# EAGLE design n64rgb (EAGLE 8.4.3)
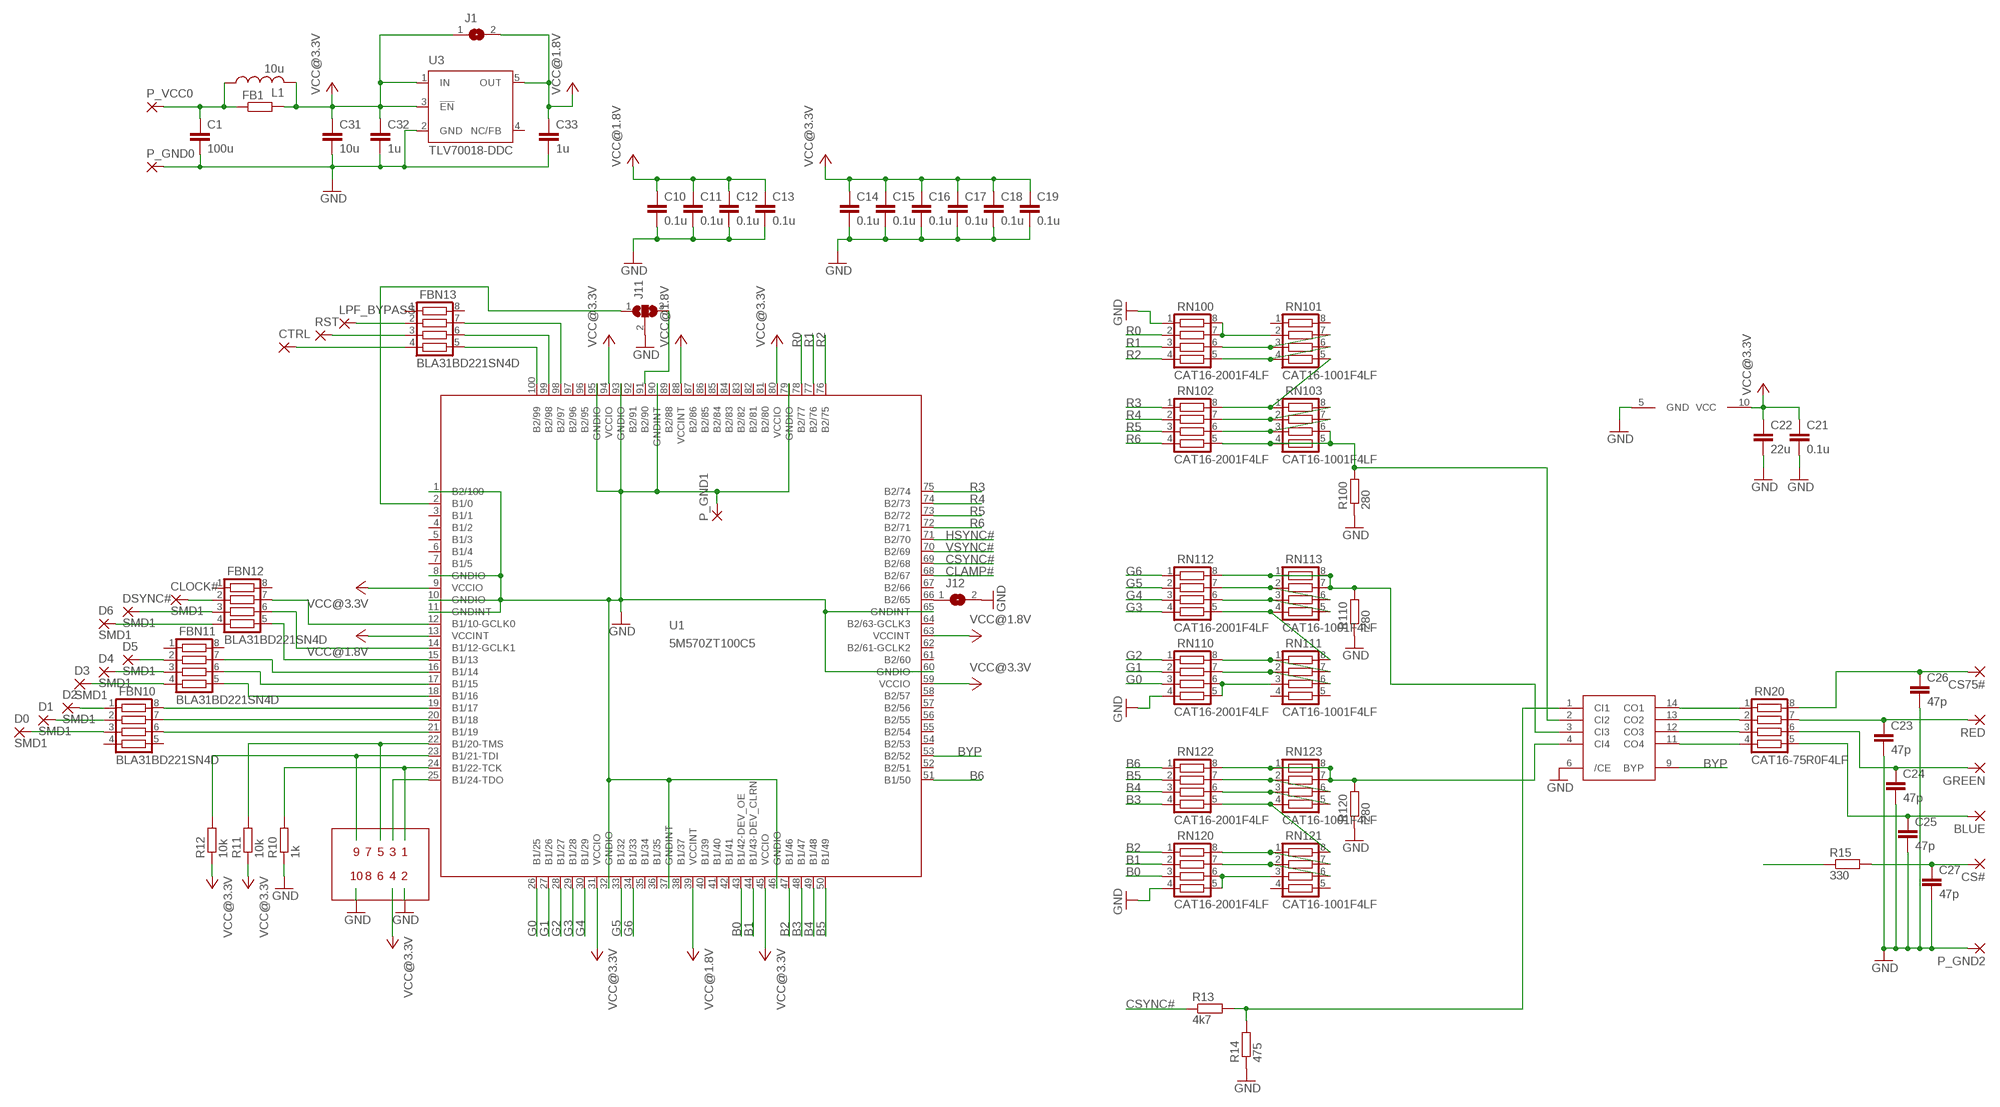
[diagram p0: schematic, sheet 1]

## Parts
BLUE  SMD2  [SMD1,27-2,54]
C1  100u  C-EUC1206K  [C1206K]
C10  0.1u  C-EUC0603  [C0603]
C11  0.1u  C-EUC0603  [C0603]
C12  0.1u  C-EUC0603  [C0603]
C13  0.1u  C-EUC0603  [C0603]
C14  0.1u  C-EUC0603  [C0603]
C15  0.1u  C-EUC0603  [C0603]
C16  0.1u  C-EUC0603  [C0603]
C17  0.1u  C-EUC0603  [C0603]
C18  0.1u  C-EUC0603  [C0603]
C19  0.1u  C-EUC0603  [C0603]
C21  0.1u  C-EUC0603  [C0603]
C22  22u  C-EUC1206K  [C1206K]
C23  47p  C-EUC0603  [C0603]
C24  47p  C-EUC0603  [C0603]
C25  47p  C-EUC0603  [C0603]
C26  47p  C-EUC0603  [C0603]
C27  47p  C-EUC0603  [C0603]
C31  10u  C-EUC1206K  [C1206K]
C32  1u  C-EUC0603  [C0603]
C33  1u  C-EUC0603  [C0603]
CLOCK#  SMD1  [SMD0,8-1,6]
CS75#  SMD2  [SMD1,27-2,54]
CS#  SMD2  [SMD1,27-2,54]
CTRL  SMD2  [SMD1,27-2,54]
D0  SMD1  [SMD0,8-1,6]
D1  SMD1  [SMD0,8-1,6]
D2  SMD1  [SMD0,8-1,6]
D3  SMD1  [SMD0,8-1,6]
D4  SMD1  [SMD0,8-1,6]
D5  SMD1  [SMD0,8-1,6]
D6  SMD1  [SMD0,8-1,6]
DSYNC#  SMD1  [SMD0,8-1,6]
FB1  R-EU_R0603  [R0603]
FBN10  BLA31BD221SN4D  CTS742C083  [CTS742C083]
FBN11  BLA31BD221SN4D  CTS742C083  [CTS742C083]
FBN12  BLA31BD221SN4D  CTS742C083  [CTS742C083]
FBN13  BLA31BD221SN4D  CTS742C083  [CTS742C083]
GREEN  SMD2  [SMD1,27-2,54]
J1  SJ  [SJ]
J11  SJ2W  [SJ_2]
J12  SJ  [SJ]
L1  10u  L-USL3230M  [L3230M]
LPF_BYPASS  SMD2  [SMD1,27-2,54]
P_GND0  SMD2  [SMD1,27-2,54]
P_GND1  SMD2  [SMD1,27-2,54]
P_GND2  SMD2  [SMD1,27-2,54]
P_VCC0  SMD2  [SMD1,27-2,54]
R10  1k  R-EU_R0603  [R0603]
R11  10k  R-EU_R0603  [R0603]
R12  10k  R-EU_R0603  [R0603]
R13  4k7  R-EU_R0603  [R0603]
R14  475  R-EU_R0603  [R0603]
R15  330  R-EU_R0603  [R0603]
R100  280  R-EU_R0603  [R0603]
R110  280  R-EU_R0603  [R0603]
R120  280  R-EU_R0603  [R0603]
RED  SMD2  [SMD1,27-2,54]
RN20  CAT16-75R0F4LF  CTS742C083  [CTS742C083]
RN100  CAT16-2001F4LF  CTS742C083  [CTS742C083]
RN101  CAT16-1001F4LF  CTS742C083  [CTS742C083]
RN102  CAT16-2001F4LF  CTS742C083  [CTS742C083]
RN103  CAT16-1001F4LF  CTS742C083  [CTS742C083]
RN110  CAT16-2001F4LF  CTS742C083  [CTS742C083]
RN111  CAT16-1001F4LF  CTS742C083  [CTS742C083]
RN112  CAT16-2001F4LF  CTS742C083  [CTS742C083]
RN113  CAT16-1001F4LF  CTS742C083  [CTS742C083]
RN120  CAT16-2001F4LF  CTS742C083  [CTS742C083]
RN121  CAT16-1001F4LF  CTS742C083  [CTS742C083]
RN122  CAT16-2001F4LF  CTS742C083  [CTS742C083]
RN123  CAT16-1001F4LF  CTS742C083  [CTS742C083]
RST  SMD2  [SMD1,27-2,54]
U1  5M570ZT100C5  [TQFP100]
U2  THS7374  [THS7374]
U3  TLV70018-DDC  TPS77018  [SOT23-DBV]

## Nets
B0: RN120.3 U1.43(B1/42-DEV_OE)
B1: RN120.2 U1.44(B1/43-DEV_CLRN)
B2: RN120.1 U1.47(B1/46)
B3: RN122.4 U1.48(B1/47)
B4: RN122.3 U1.49(B1/48)
B5: RN122.2 U1.50(B1/49)
B6: RN122.1 U1.51(B1/50)
BYP: U1.53(B2/52) U2.9(BYP)
CLAMP#: U1.68(B2/67)
CSYNC#: R13.1 R15.1 U1.69(B2/68)
G0: RN110.3 U1.26(B1/25)
G1: RN110.2 U1.27(B1/26)
G2: RN110.1 U1.28(B1/27)
G3: RN112.4 U1.29(B1/28)
G4: RN112.3 U1.30(B1/29)
G5: RN112.2 U1.33(B1/32)
G6: RN112.1 U1.34(B1/33)
GND: C1.2 C10.2 C11.2 C12.2 C13.2 C14.2 C15.2 C16.2 C17.2 C18.2 C19.2 C21.2 C22.2 C23.2 C24.2 C25.2 C26.2 C27.2 C31.2 C32.2 C33.2 J11.2 J12.2 P_GND0.1(P) P_GND1.1(P) P_GND2.1(P) R10.1 R14.1 R100.1 R110.1 R120.1 RN100.1 RN110.4 RN120.4 U1.1(B2/100) U1.8(GNDIO) U1.10(GNDIO) U1.11(GNDINT) U1.32(GNDIO) U1.37(GNDINT) U1.46(GNDIO) U1.60(GNDIO) U1.65(GNDINT) U1.79(GNDIO) U1.90(GNDINT) U1.93(GNDIO) U1.95(GNDIO) U2.5(GND) U2.6(/CE) U3.2(GND)
HSYNC#: U1.71(B2/70)
N$1: R13.2 R14.2 U2.1(CI1)
N$2: C23.1 RED.1(P) RN20.7
N$3: RN20.1 U2.14(CO1)
N$4: RN20.2 U2.13(CO2)
N$5: RN20.3 U2.12(CO3)
N$6: RN20.4 U2.11(CO4)
N$7: CTRL.1(P) FBN13.4
N$8: FBN13.3 RST.1(P)
N$9: FBN13.2 LPF_BYPASS.1(P)
N$10: C24.1 GREEN.1(P) RN20.6
N$11: BLUE.1(P) C25.1 RN20.5
N$12: C26.1 CS75#.1(P) RN20.8
N$13: C27.1 CS#.1(P) R15.2
N$14: FBN13.5 U1.100(B2/99)
N$15: D1.P$1(P) FBN10.2
N$16: D0.P$1(P) FBN10.3
N$17: D2.P$1(P) FBN10.1
N$18: FBN10.6 U1.21(B1/19)
N$19: FBN10.7 U1.20(B1/18)
N$20: FBN10.8 U1.19(B1/17)
N$21: D3.P$1(P) FBN11.4
N$22: D4.P$1(P) FBN11.3
N$23: D5.P$1(P) FBN11.2
N$24: D6.P$1(P) FBN12.4
N$25: RN110.5 RN110.6 RN111.3
N$26: RN110.7 RN111.2 RN111.6
N$27: RN110.8 RN111.1 RN111.7
N$28: RN111.8 RN112.5 RN113.4
N$29: RN112.6 RN113.3 RN113.5
N$30: RN112.7 RN113.2 RN113.6
N$31: R120.2 RN122.8 RN123.1 RN123.7 RN123.8 U2.4(CI4)
N$32: RN120.5 RN120.6 RN121.3
N$33: RN120.7 RN121.2 RN121.6
N$34: RN120.8 RN121.1 RN121.7
N$35: RN121.8 RN122.5 RN123.4
N$36: DSYNC#.P$1(P) FBN12.3
N$37: RN122.6 RN123.3 RN123.5
N$38: RN122.7 RN123.2 RN123.6
N$39: CLOCK#.P$1(P) FBN12.2
N$40: FBN11.5 U1.18(B1/16)
N$41: FBN11.6 U1.17(B1/15)
N$42: FBN11.7 U1.16(B1/14)
N$43: FBN12.5 U1.15(B1/13)
N$44: FBN12.6 U1.14(B1/12-GCLK1)
N$45: FBN12.7 U1.12(B1/10-GCLK0)
N$46: FBN13.6 U1.99(B2/98)
N$47: FBN13.7 U1.98(B2/97)
N$48: R100.2 RN102.5 RN103.4 RN103.5 RN103.6 U2.2(CI2)
N$49: J12.1 U1.66(B2/65)
N$51: J11.3 U1.91(B2/90)
N$52: J11.1 U1.2(B1/0)
N$54: C1.1 FB1.1 L1.1 P_VCC0.1(P)
N$76: R110.2 RN112.8 RN113.1 RN113.7 RN113.8 U2.3(CI3)
N$77: RN100.7 RN100.8 RN101.2
N$78: RN100.6 RN101.3 RN101.7
N$79: RN100.5 RN101.4 RN101.6
N$80: RN101.5 RN102.8 RN103.1
N$81: RN102.7 RN103.2 RN103.8
N$82: RN102.6 RN103.3 RN103.7
R0: RN100.2 U1.78(B2/77)
R1: RN100.3 U1.77(B2/76)
R2: RN100.4 U1.76(B2/75)
R3: RN102.1 U1.75(B2/74)
R4: RN102.2 U1.74(B2/73)
R5: RN102.3 U1.73(B2/72)
R6: RN102.4 U1.72(B2/71)
TCK: R10.2 U1.24(B1/22-TCK)
TDI: R12.2 U1.23(B1/21-TDI)
TDO: U1.25(B1/24-TDO)
TMS: R11.2 U1.22(B1/20-TMS)
VCC@1.8V: C10.1 C11.1 C12.1 C13.1 C33.1 J1.2 U1.13(VCCINT) U1.39(VCCINT) U1.63(VCCINT) U1.88(VCCINT) U3.5(OUT)
VCC@3.3V: C14.1 C15.1 C16.1 C17.1 C18.1 C19.1 C21.1 C22.1 C31.1 C32.1 FB1.2 J1.1 L1.2 R11.1 R12.1 U1.9(VCCIO) U1.31(VCCIO) U1.45(VCCIO) U1.59(VCCIO) U1.80(VCCIO) U1.94(VCCIO) U2.10(VCC) U3.1(IN) U3.3(!EN)
VSYNC#: U1.70(B2/69)
Unconnected: FBN10.4 FBN10.5 FBN11.1 FBN11.8 FBN12.1 FBN12.8 FBN13.1 FBN13.8 RN101.1 RN101.8 RN111.4 RN111.5 RN121.4 RN121.5 U1.3(B1/1) U1.4(B1/2) U1.5(B1/3) U1.6(B1/4) U1.7(B1/5) U1.35(B1/34) U1.36(B1/35) U1.38(B1/37) U1.40(B1/39) U1.41(B1/40) U1.42(B1/41) U1.52(B2/51) U1.54(B2/53) U1.55(B2/54) U1.56(B2/55) U1.57(B2/56) U1.58(B2/57) U1.61(B2/60) U1.62(B2/61-GCLK2) U1.64(B2/63-GCLK3) U1.67(B2/66) U1.81(B2/80) U1.82(B2/81) U1.83(B2/82) U1.84(B2/83) U1.85(B2/84) U1.86(B2/85) U1.87(B2/86) U1.89(B2/88) U1.92(B2/91) U1.96(B2/95) U1.97(B2/96) U3.4(NC/FB)

## Notes on the sheet
- 9 | 7 | 5 | 3 | 1
- 10 | 8 | 6 | 4 | 2

## Library data of the parts
BLUE CS75# CS# CTRL GREEN LPF_BYPASS P_GND0 P_GND1 P_GND2 P_VCC0 RED RST = wirepad:SMD2: SMD PAD
C1 C10-C19 C21-C27 C31-C33 = rcl:C-EU: CAPACITOR, European symbol
CLOCK# D0 D1-D6 DSYNC# = wirepad:SMD1
FB1 R10-R15 R100 R110 R120 = rcl:R-EU_: RESISTOR, European symbol
FBN10-FBN13 RN20 RN100-RN103 RN110-RN113 RN120-RN123 = resistor-net:CTS742C083: Chip Resistor Array 4 Single Resistor Source: http://www.ctscorp.com/components/Datasheets/CTSChipArrayDs.pdf; OC_FARNELL: unknown; OC_NEWARK: unknown
J1 J12 = jumper:SJ: SMD solder JUMPER
J11 = jumper:SJ2W: SMD solder JUMPER
L1 = rcl:L-US: INDUCTOR, American symbol
U1 = altera:5M570ZT100C5
U2 = snes_div:THS7374
U3 = texas:TPS770*: ULTRALOW-POWER 50-mA LOW-DROPOUT LINEAR REGULATORS 50-mA Low-Dropout Regulator Source: http://focus.ti.com/lit/ds/symlink/tps77001.pdf; MF: TEXAS INSTRUMENT CONNECTORS; MPN: TPS77018DBVR; OC_FARNELL: 1575745; OC_NEWARK: 77C1176

## Board
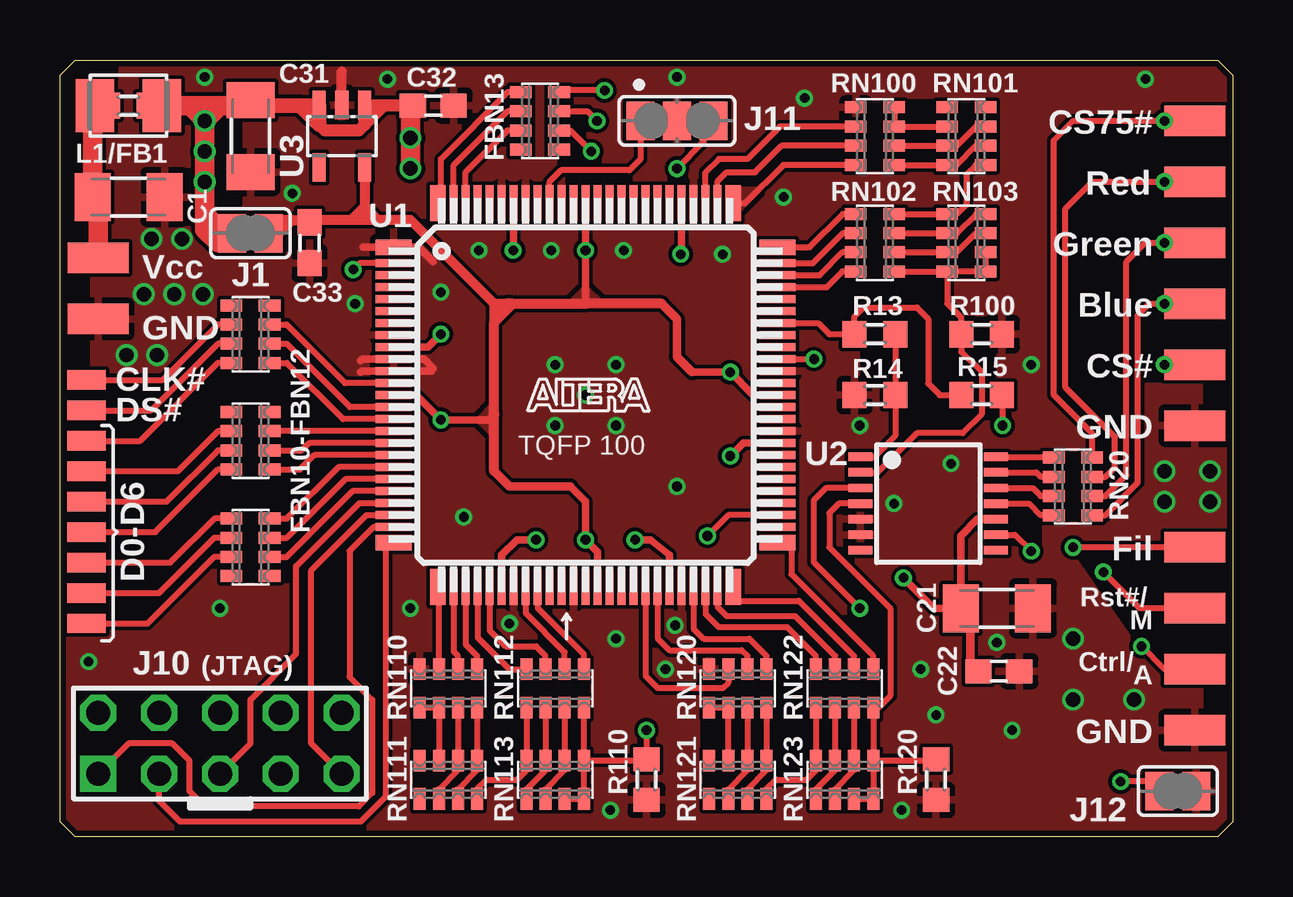
[diagram p1: board, top side]
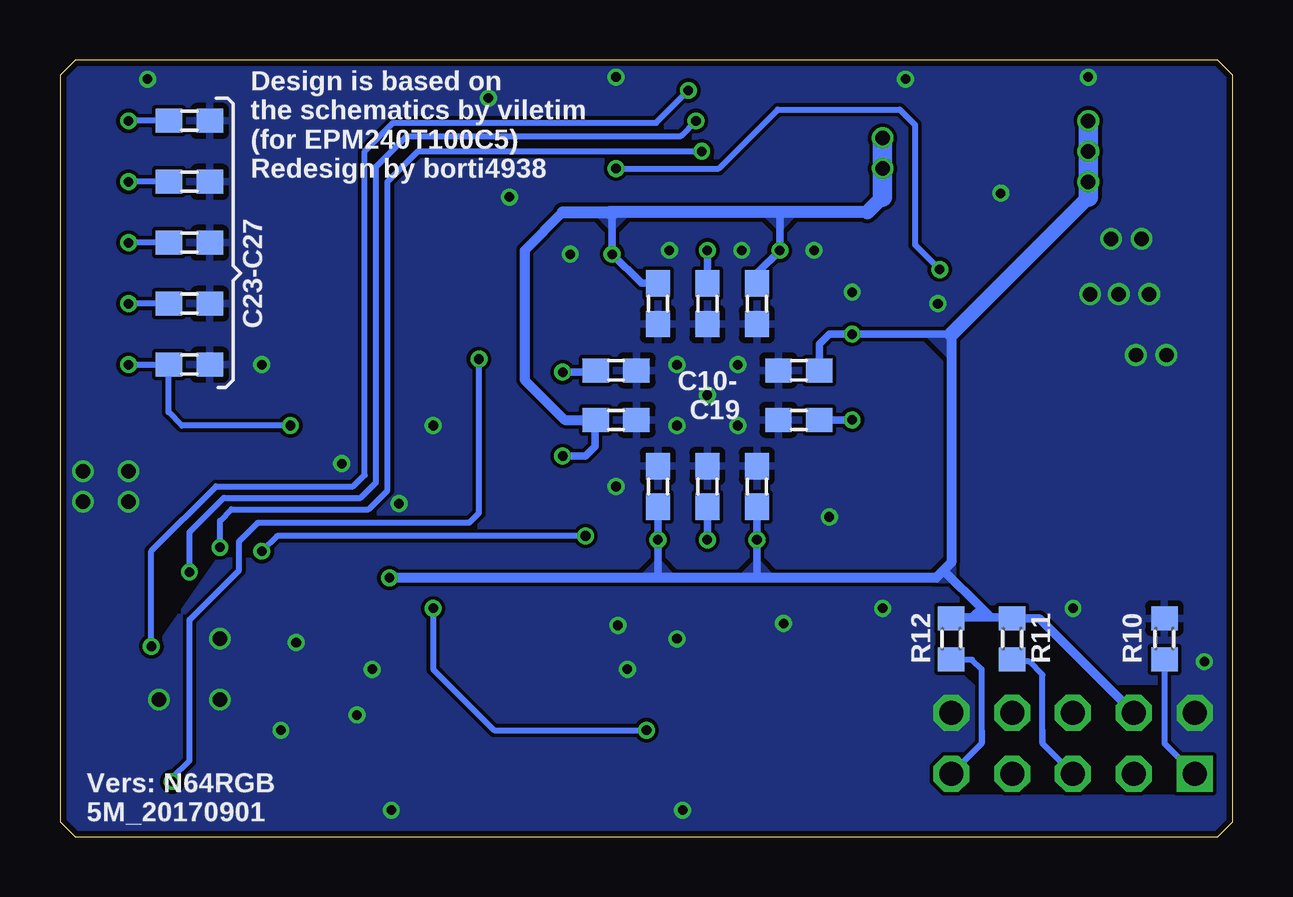
[diagram p2: board, bottom side, seen from below]

Size 48.89 x 32.39 mm. Coordinates in mm from the lower left corner, seen from the top.
Outline: 0.63,0 0,0.64 0,31.75 0.63,32.39 48.26,32.39 48.89,31.75 48.89,0.64 48.26,0 0.63,0
Copper layers (1*16): Top 0.035mm / dielectric 1.5mm / Bottom 0.035mm
Design rules "ITEADstudio_DRC": minimum track width 6mil, minimum drill 12mil, track to track 6mil, track to pad 6mil, pad to pad 6mil, via to via 6mil, smd to smd 0mil, copper to edge 10mil, drill to drill 10mil, minimum pad ring 10mil, minimum via ring 6mil, stop-mask expansion 2mil, vias tented up to drill 30mil, thermal gap 10mil
tRestrict: area 7.5,19.6 to 8.3,22.3; area 7.5,10.7 to 8.3,13.4; area 7.5,15.2 to 8.3,17.9; area 14.8,5.8 to 17.5,6.6; area 19.3,5.8 to 22,6.6; area 14.8,2 to 17.5,2.8; area 19.2,2 to 21.9,2.8; area 26.9,2 to 29.6,2.8; area 26.9,5.8 to 29.6,6.6; area 31.4,5.8 to 34.1,6.6; area 31.4,2 to 34.1,2.8; area 41.8,13.3 to 42.6,16; 18 more areas
bRestrict: area 42.2,7.9 to 45.1,12.1; area 0.9,1.9 to 12.3,8.8

### Footprints (pad centres in the part's own frame; a part is rotated, then mirrored left to right if it is on the bottom)
SMD1,27-2,54 = smd 1.27 x 2.54: 1 0,0
C1206K = smd 1.5 x 2: 1 -1.5,0; 2 1.5,0
C0603 = smd 1.1 x 1: 1 -0.85,0; 2 0.85,0
SMD0,8-1,6 = smd 0.8 x 1.6: P$1 0,0
R0603 = smd 1 x 1.1: 1 -0.85,0; 2 0.85,0
CTS742C083 = smd 0.5 x 0.9: 1 -1.2,-0.8; 2 -0.4,-0.8; 3 0.4,-0.8; 4 1.2,-0.8; 5 1.2,0.8; 6 0.4,0.8; 7 -0.4,0.8; 8 -1.2,0.8
SJ = smd 1.168 x 1.6: 1 -0.762,0; 2 0.762,0
SJ_2 = smd 1.168 x 1.6: 1 -1.524,0; 2 0,0; 3 1.524,0
L3230M = smd 1.6 x 2.2: 1 -1.4,0; 2 1.4,0
TQFP100 = smd 1.5 x 0.64: 1 -8,6.16; 25 -8,-6.16; 51 8,-6.16; 75 8,6.16 | smd 1.5 x 0.32: 2 -8,5.5; 3 -8,5; 4 -8,4.5; 5 -8,4; 6 -8,3.5; 7 -8,3; 8 -8,2.5; 9 -8,2; 10 -8,1.5; 11 -8,1; 12 -8,0.5; 13 -8,0; 14 -8,-0.5; 15 -8,-1; 16 -8,-1.5; 17 -8,-2; 18 -8,-2.5; 19 -8,-3; 20 -8,-3.5; 21 -8,-4; 22 -8,-4.5; 23 -8,-5; 24 -8,-5.5; 52 8,-5.5; 53 8,-5; 54 8,-4.5; 55 8,-4; 56 8,-3.5; 57 8,-3; 58 8,-2.5; 59 8,-2; 60 8,-1.5; 61 8,-1; 62 8,-0.5; 63 8,0; 64 8,0.5; 65 8,1; 66 8,1.5; 67 8,2; 68 8,2.5; 69 8,3; 70 8,3.5; 71 8,4; 72 8,4.5; 73 8,5; 74 8,5.5 | smd 0.64 x 1.5: 26 -6.16,-8; 50 6.16,-8; 76 6.16,8; 100 -6.16,8 | smd 0.32 x 1.5: 27 -5.5,-8; 28 -5,-8; 29 -4.5,-8; 30 -4,-8; 31 -3.5,-8; 32 -3,-8; 33 -2.5,-8; 34 -2,-8; 35 -1.5,-8; 36 -1,-8; 37 -0.5,-8; 38 0,-8; 39 0.5,-8; 40 1,-8; 41 1.5,-8; 42 2,-8; 43 2.5,-8; 44 3,-8; 45 3.5,-8; 46 4,-8; 47 4.5,-8; 48 5,-8; 49 5.5,-8; 77 5.5,8; 78 5,8; 79 4.5,8; 80 4,8; 81 3.5,8; 82 3,8; 83 2.5,8; 84 2,8; 85 1.5,8; 86 1,8; 87 0.5,8; 88 0,8; 89 -0.5,8; 90 -1,8; 91 -1.5,8; 92 -2,8; 93 -2.5,8; 94 -3,8; 95 -3.5,8; 96 -4,8; 97 -4.5,8; 98 -5,8; 99 -5.5,8
THS7374 = smd 0.35 x 1: 1 -1.95,-2.825; 2 -1.3,-2.825; 3 -0.65,-2.825; 4 0,-2.825; 5 0.65,-2.825; 6 1.3,-2.825; 7 1.95,-2.825; 8 1.95,2.825; 9 1.3,2.825; 10 0.65,2.825; 11 0,2.825; 12 -0.65,2.825; 13 -1.3,2.825; 14 -1.95,2.825
SOT23-DBV = smd 0.55 x 1.2: 1 -0.95,-1.3; 2 0,-1.3; 3 0.95,-1.3; 4 0.95,1.3; 5 -0.95,1.3

### Placement (x,y rotation side)
BLUE  47.31,22.22 90 top
C1  2.86,26.67 0 top
C10  18.1,17.38 180 bottom
C11  21.91,14.61 90 bottom
C12  25.72,19.45 0 bottom
C13  21.91,22.22 270 bottom
C14  18.1,19.45 180 bottom
C15  19.84,14.61 90 bottom
C16  23.97,14.61 90 bottom
C17  25.72,17.38 0 bottom
C18  23.97,22.22 270 bottom
C19  19.84,22.22 270 bottom
C21  39.13,6.91 0 top
C22  39.05,9.53 0 top
C23  43.5,27.3 0 bottom
C24  43.5,24.76 0 bottom
C25  43.5,22.22 0 bottom
C26  43.5,29.84 0 bottom
C27  43.5,19.68 0 bottom
C31  7.94,29.21 270 top
C32  15.56,30.48 0 top
C33  10.4,24.76 270 top
CLOCK#  [SMD0,8-1,6]  1.11,19.05 90 top
CS75#  47.31,29.84 90 top
CS#  47.31,19.68 90 top
CTRL  47.31,6.99 90 top
D0  [SMD0,8-1,6]  1.11,8.89 90 top
D1  [SMD0,8-1,6]  1.11,10.16 90 top
D2  [SMD0,8-1,6]  1.11,11.43 90 top
D3  [SMD0,8-1,6]  1.11,12.7 90 top
D4  [SMD0,8-1,6]  1.11,13.97 90 top
D5  [SMD0,8-1,6]  1.11,15.24 90 top
D6  [SMD0,8-1,6]  1.11,16.51 90 top
DSYNC#  [SMD0,8-1,6]  1.11,17.78 90 top
FB1  2.86,30.48 0 top
FBN10  7.94,12.06 270 top
FBN11  7.94,16.51 270 top
FBN12  7.94,20.95 270 top
FBN13  20,29.84 90 top
GREEN  47.31,24.76 90 top
J1  7.94,25.16 0 top
J11  25.72,29.84 180 top
J12  46.59,1.91 0 top
L1  2.86,30.48 0 top
LPF_BYPASS  47.31,12.06 270 top
P_GND0  1.59,21.59 90 top
P_GND1  47.31,17.14 270 top
P_GND2  47.31,4.45 90 top
P_VCC0  1.59,24.13 90 top
R10  2.86,8.26 270 bottom
R11  9.21,8.26 270 bottom
R12  11.75,8.26 270 bottom
R13  33.97,20.95 0 top
R14  33.97,18.41 0 top
R15  38.42,18.41 0 top
R100  38.42,20.95 180 top
R110  24.45,2.38 90 top
R120  36.51,2.38 90 top
RED  47.31,27.3 90 top
RN20  42.23,14.61 270 top
RN100  33.97,29.21 270 top
RN101  37.78,29.21 270 top
RN102  33.97,24.76 270 top
RN103  37.78,24.76 270 top
RN110  16.19,6.19 180 top
RN111  16.19,2.38 180 top
RN112  20.64,6.19 180 top
RN113  20.64,2.38 180 top
RN120  28.26,6.19 180 top
RN121  28.26,2.38 180 top
RN122  32.7,6.19 180 top
RN123  32.7,2.38 180 top
RST  47.31,9.53 270 top
U1  21.91,18.41 0 top
U2  36.2,13.89 270 top
U3  11.75,29.21 180 top

### Tracks (layer width: path | path; a pad name or v marks a point on that pad's centre or on a via)
B0
  Top 0.254: RN120.3 27.86,6.43 27.62,6.19 24.92,6.19 24.41,6.71 U1.43
B1
  Top 0.254: U1.44 24.91,8.27 25.4,7.78 28.42,7.78 28.66,7.54 RN120.2
B2
  Top 0.254: U1.47 26.41,8.68 26.83,8.26 28.73,8.26 29.46,7.53 RN120.1
B3
  Top 0.254: RN122.4 31.5,7.55 30.32,8.73 27.46,8.73 26.91,9.29 U1.48
B4
  Top 0.254: U1.49 27.41,9.58 27.78,9.21 30.64,9.21 32.3,7.54 RN122.3
B5
  Top 0.254: U1.50 28.07,9.87 28.1,9.84 30.8,9.84 33.1,7.54 RN122.2
B6
  Top 0.254: U1.51 30.45,12.26 30.48,12.22 30.48,10.95 33.9,7.53 RN122.1
BYP  (via drill 0.4)
  Top 0.254: U1.53 27.86,13.42 v26.99,12.54 | U2.9 39.8,12.59 v40.48,11.91
  Bottom 0.254: v26.99,12.54 39.85,12.54 v40.48,11.91
CSYNC#
  Top 0.254: U1.69 31.61,21.41 32.07,20.95 R13.1 33.12,21.69 33.5,22.07 35.72,22.07 36.2,21.59 36.2,18.89 36.67,18.41 R15.1
G0
  Top 0.254: RN110.3 15.79,10.37 U1.26
G1
  Top 0.254: RN110.2 16.59,7.54 16.41,7.72 U1.27
G2
  Top 0.254: RN110.1 17.39,7.53 16.91,8.02 U1.28
G3
  Top 0.254: U1.29 17.41,8.31 18.73,6.99 RN112.4
G4
  Top 0.254: U1.30 17.91,8.6 18.57,7.94 19.84,7.94 20.24,7.54 RN112.3
G5
  Top 0.254: U1.33 19.41,9.33 21.04,7.7 RN112.2
G6
  Top 0.254: U1.34 19.91,9.54 21.84,7.61 RN112.1
GND  (via drill 0.4, 0.6, 1)
  Top 0.305: 12.54,19.84 12.61,19.91 U1.10 15.17,19.91 15.56,19.53 | 12.54,19.37 12.59,19.41 U1.11 15.5,19.41 | 15.56,23.97 14.95,24.57 U1.1 12.64,24.57
  Top 0.406: 11.75,30.64 11.75,31.91
  other vias: 5.95,22.62 3.49,22.62 4.76,22.62 3.81,24.92 4.05,20.08 6.03,31.67 13.65,31.59 17.46,24.45 20.48,24.45 27.62,24.29 21.91,18.41 23.18,19.68 20.64,19.68 20.64,17.14 23.18,17.14 25.24,6.99 1.19,7.3 22.94,1.11 35.08,1.11 39.69,4.45 44.77,5.71 25.64,8.81 42.23,5.71 36.51,5.08 33.34,17.14 40.48,19.68 31.04,30.8 39.05,8.1 46.04,15.24 47.94,15.24 46.04,13.97 47.94,13.97 23.18,8.26 12.3,22.22 15.88,22.7 9.68,26.83 18.73,8.89 25.72,14.61 45.24,31.59 25.72,31.67 1.59,5.16 11.75,5.16 2.78,20.08 37.15,15.56 6.67,9.53 30.16,26.67 14.6,9.53 23.5,24.45 35.88,6.99 16.83,13.34 34.77,13.89 42.23,8.26 5.08,24.92
  pour Top (rank 6): -0.95,-0.64 49.85,-0.64 49.85,33.66 -0.95,33.66
  pour Bottom (rank 6): -0.95,-0.64 49.85,-0.64 49.85,33.66 -0.95,33.66
N$1
  Top 0.254: R13.2 R14.2 34.82,16.72 33.94,15.84 U2.1
N$2  (via drill 0.4)
  Top 0.254: RED.1 v46.04,27.3 43.02,27.3 41.91,26.19 41.91,18.73 43.97,16.67 43.97,15.4 43.58,15.01 RN20.7
  Bottom 0.254: C23.1 v46.04,27.3
N$3
  Top 0.254: U2.14 41.39,15.84 RN20.1
N$4
  Top 0.254: U2.13 40.69,15.19 40.88,15.01 RN20.2
N$5
  Top 0.254: U2.12 40.55,14.54 40.88,14.21 RN20.3
N$6
  Top 0.254: U2.11 40.4,13.89 40.89,13.4 RN20.4
N$7  (via drill 0.4)
  Top 0.254: CTRL.1 46.04,6.99 v45.09,7.94 | v22.7,31.11 20.87,31.11 FBN13.4
  Bottom 0.254: v45.09,7.94 45.09,11.91 42.39,14.61 36.67,14.61 36.2,15.08 36.2,28.57 35,29.77 24.05,29.77 v22.7,31.11
N$8  (via drill 0.4)
  Top 0.254: RST.1 45.01,9.53 v43.5,11.03 | FBN13.3 21.98,30.24 v22.38,29.84
  Bottom 0.254: v22.38,29.84 23.02,29.21 34.45,29.21 35.72,27.94 35.72,14.76 36.35,14.13 42.07,14.13 43.5,12.7 v43.5,11.03
N$9  (via drill 0.4)
  Top 0.254: LPF_BYPASS.1 v42.23,12.06 | FBN13.2 21.28,29.44 v22.15,28.57
  Bottom 0.254: v22.15,28.57 33.97,28.57 35.24,27.3 35.24,14.45 36.04,13.65 41.75,13.65 42.23,13.18 v42.23,12.06
N$10  (via drill 0.4)
  Top 0.254: GREEN.1 v46.04,24.76 45.24,24.76 44.45,23.97 44.45,15.08 43.57,14.21 RN20.6
  Bottom 0.254: C24.1 v46.04,24.76
N$11  (via drill 0.4)
  Top 0.254: BLUE.1 v46.04,22.22 45.4,22.22 44.93,21.75 44.93,14.76 43.57,13.4 RN20.5
  Bottom 0.254: C25.1 v46.04,22.22
N$12  (via drill 0.4)
  Top 0.254: CS75#.1 v46.04,29.84 42.23,29.84 41.43,29.05 41.43,18.41 43.03,16.82 RN20.8
  Bottom 0.254: C26.1 v46.04,29.84
N$13  (via drill 0.4)
  Top 0.254: CS#.1 v46.04,19.68 | R15.2 39.29,18.41 v39.29,17.14
  Bottom 0.254: v46.04,19.68 C27.1 44.37,19.66 44.37,17.7 43.81,17.14 v39.29,17.14
N$14
  Top 0.254: U1.100 15.78,26.41 15.88,26.43 15.88,28.26 18.66,31.04 FBN13.5
N$15
  Top 0.254: D1.P$1 4.13,10.16 6.43,12.46 FBN10.2
N$16
  Top 0.254: FBN10.3 6.43,11.67 3.65,8.89 D0.P$1
N$17
  Top 0.254: D2.P$1 4.6,11.43 6.44,13.27 FBN10.1
N$18
  Top 0.254: U1.21 12.19,14.42 9.44,11.67 FBN10.6
N$19
  Top 0.254: U1.20 11.9,14.92 9.45,12.46 FBN10.7
N$20
  Top 0.254: U1.19 11.6,15.42 9.46,13.27 FBN10.8
N$21
  Top 0.254: D3.P$1 3.97,12.7 6.58,15.31 FBN11.4
N$22
  Top 0.254: D4.P$1 4.44,13.97 6.58,16.11 FBN11.3
N$23
  Top 0.254: D5.P$1 4.92,15.24 6.59,16.91 FBN11.2
N$24
  Top 0.254: D6.P$1 3.33,16.51 6.58,19.75 FBN12.4
N$25
  Top 0.254: RN110.5 RN110.6 RN111.3
N$26
  Top 0.254: RN110.7 RN111.2 16.59,2.78 15.79,1.98 RN111.6
N$27
  Top 0.254: RN110.8 RN111.1 17.39,2.79 16.59,1.99 RN111.7
N$28
  Top 0.254: RN112.5 RN113.4 19.44,2.77 19.05,2.38 17.78,2.38 17.39,1.99 RN111.8
N$29
  Top 0.254: RN112.6 RN113.3 20.24,2.78 19.44,1.97 RN113.5
N$30
  Top 0.254: RN112.7 RN113.2 21.04,2.78 20.24,1.98 RN113.6
N$31
  Top 0.254: RN123.1 RN122.8 34.13,5.39 34.61,5.87 34.61,9.53 32.07,12.06 32.07,13.49 32.46,13.89 U2.4 | RN123.1 RN123.8 RN123.7 | RN123.1 36.46,3.18 R120.2
N$32
  Top 0.254: RN120.5 RN120.6 RN121.3
N$33
  Top 0.254: RN120.7 RN121.2 28.66,2.78 27.86,1.98 RN121.6
N$34
  Top 0.254: RN120.8 RN121.1 29.46,2.79 28.66,1.99 RN121.7
N$35
  Top 0.254: RN121.8 29.46,1.99 29.84,2.38 31.12,2.38 31.5,2.77 RN123.4 RN122.5
N$36
  Top 0.254: DSYNC#.P$1 3.81,17.78 6.58,20.55 FBN12.3
N$37
  Top 0.254: RN123.5 31.5,1.97 32.3,2.78 RN123.3 RN122.6
N$38
  Top 0.254: RN123.6 32.3,1.98 33.1,2.78 RN123.2 RN122.7
N$39
  Top 0.254: CLOCK#.P$1 4.29,19.05 6.59,21.35 FBN12.2
N$40
  Top 0.254: U1.18 10.6,15.92 9.99,15.31 FBN11.5
N$41
  Top 0.254: U1.17 10.38,16.41 10.08,16.11 FBN11.6
N$42
  Top 0.254: U1.16 FBN11.7
N$43
  Top 0.254: U1.15 11.8,17.41 9.46,19.75 FBN12.5
N$44
  Top 0.254: U1.14 12.09,17.91 9.45,20.55 FBN12.6
N$45
  Top 0.254: U1.12 11.88,18.91 9.44,21.35 FBN12.7
N$46
  Top 0.254: U1.99 16.41,28 18.66,30.24 FBN13.6
N$47
  Top 0.254: U1.98 16.91,27.7 18.65,29.44 FBN13.7
N$48
  Top 0.254: RN103.4 RN103.5 RN103.6 | RN102.5 RN103.4 | RN103.4 36.98,22.23 37.57,21.65 R100.2 37.57,20.22 38.42,19.37 38.42,17.62 37.62,16.83 35.72,16.83 34.08,15.19 U2.2
N$49  (via drill 0.4)
  Top 0.254: J12.1 45.8,1.91 45.4,2.3 v44.21,2.3 | U1.66 v31.43,19.91
  Bottom 0.254: v44.21,2.3 44.21,2.46 43.5,3.17 43.5,9.05 41.43,11.11 41.43,12.3 40.64,13.1 31.83,13.1 31.43,13.49 v31.43,19.91
N$50  (via drill 1)
  other vias: 9.21,2.62
N$51
  Top 0.254: J11.3 24.19,28.24 23.73,27.78 20.88,27.78 20.41,27.31 U1.91
N$52  (via drill 0.4)
  Top 0.254: 12.38,23.81 v12.22,23.65 12.49,23.91 U1.2 | J11.1 27.24,29.7 26.83,29.29 26.83,28.97 v25.72,27.86
  Bottom 0.254: v12.22,23.65 13.26,24.69 13.26,29.69 13.89,30.32 18.97,30.32 21.43,27.86 v25.72,27.86
N$54
  Top 0.406: 1.59,26.44 C1.1 | 1.36,30.38 L1.1 FB1.1
  Top 0.813: P_VCC0.1 1.59,26.44 | C1.1 1.36,30.38
N$55  (via drill 1)
  other vias: 6.67,5.16
N$56  (via drill 1)
  other vias: 9.21,5.16
N$76  (via drill 0.4)
  Top 0.254: RN113.7 RN113.8 RN113.1 | RN113.1 RN112.8 | RN113.1 24.4,3.18 R110.2 v24.45,4.45 | v33.34,9.53 31.43,11.43 31.43,14.05 31.92,14.54 U2.3
  Bottom 0.254: v33.34,9.53 33.34,6.99 30.8,4.45 v24.45,4.45
N$77
  Top 0.254: RN101.2 RN100.7 RN100.8
N$78
  Top 0.254: RN100.6 RN101.3 37.38,28.81 38.18,29.61 RN101.7
N$79
  Top 0.254: RN100.5 RN101.4 37.38,28.01 38.18,28.81 RN101.6
N$80
  Top 0.254: RN102.8 RN103.1 37.39,25.96 37.78,26.35 37.78,27.62 38.17,28.01 RN101.5
N$81
  Top 0.254: RN102.7 RN103.2 37.39,25.16 38.19,25.96 RN103.8
N$82
  Top 0.254: RN102.6 RN103.3 37.38,24.36 38.18,25.16 RN103.7
R0
  Top 0.254: RN100.2 30.01,29.61 28.65,28.26 27.46,28.26 26.91,27.7 U1.78
R1
  Top 0.254: U1.77 27.41,27.33 27.78,27.7 28.97,27.7 30.08,28.81 RN100.3
R2
  Top 0.254: U1.76 28.56,26.41 30.15,28.01 RN100.4
  pour Top (no thermals): 27.94,26.99 27.94,25.8 29.13,26.99
R3
  Top 0.254: RN102.1 32.63,25.96 31.24,24.57 U1.75
R4
  Top 0.254: RN102.2 32.63,25.16 31.38,23.91 U1.74
R5
  Top 0.254: RN102.3 32.62,24.36 31.67,23.41 U1.73
R6
  Top 0.254: RN102.4 32.61,23.56 31.96,22.91 U1.72
TCK  (via drill 1)
  Top 0.254: U1.24 13.07,12.92 12.07,11.91 12.07,6.67 13.02,5.71 13.02,1.83 12.46,1.27 6.03,1.27 5.4,1.91 5.4,3.17 4.68,3.89 2.86,3.89 v1.59,2.62
  Bottom 0.254: R10.2 2.86,3.89 v1.59,2.62
TDI  (via drill 1)
  Top 0.254: U1.23 12.78,13.42 10.48,11.11 10.48,3.89 v11.75,2.62
  Bottom 0.254: 10.48,3.89 10.48,4.45 | 10.48,4.45 10.48,6.99 10.87,7.38 11.72,7.38 R12.2 | 10.48,4.45 10.48,3.89 | 10.48,3.89 v11.75,2.62
TDO  (via drill 1)
  Top 0.254: U1.25 13.46,12.26 13.57,12.3 13.57,1.67 12.54,0.64 5,0.64 4.13,1.51 v4.13,2.62
TMS  (via drill 1)
  Top 0.254: U1.22 12.49,13.92 9.84,11.27 9.84,7.62 7.94,5.71 7.94,3.89 v6.67,2.62
  Bottom 0.254: 7.94,3.89 7.94,4.45 | 7.94,4.45 7.94,6.75 8.49,7.3 9.1,7.3 R11.2 | 7.94,4.45 7.94,3.89 | 7.94,3.89 v6.67,2.62
VCC@1.8V  (via drill 0.4)
  Top 0.305: U1.88 v21.91,24.45 21.91,22.22 | U1.63 28.89,18.41 v27.94,19.37 v27.93,19.37 26.35,19.37 | U1.39 22.41,11.88 v21.91,12.38 21.91,13.97 21.27,14.61 | U1.13 14.84,18.41 v15.88,17.38 17.86,17.38 18.1,17.62 | 25.72,20
  Top 0.356: 25.08,22.22 25.72,21.59 25.72,20 26.35,19.37 | 21.27,14.61 18.73,14.61 18.1,15.24
  Top 0.406: 18.1,22.22 18.57,22.22 | 18.1,22.22 18.1,21.75 | 18.1,21.75 18.1,21.43 | 18.1,21.43 18.89,22.22 | 18.89,22.22 18.57,22.22 | 18.57,22.22 18.1,21.75 | 18.1,22.22 14.6,25.72 13.26,25.72 | 18.89,22.22 21.91,22.22 25.08,22.22 | 18.1,15.24 18.1,17.62 18.1,21.43 | U3.5 12.7,26.2 13.18,25.72 12.46,25.72 | 12.46,25.72 12.14,25.72 | 12.14,25.72 12.7,26.27 13.26,25.72 | 13.26,25.72 12.86,25.72 12.7,25.88 12.62,25.88 12.46,25.72 | 12.14,25.72 10.61,25.72 | 10.5,25.72 C33.1 | C33.1 10.48,25.72 | 8.65,25.64 8.73,25.72 9.21,25.72 | 8.65,24.82 8.78,24.82 9.68,25.72 | 9.37,25.72 9.21,25.72 | 9.68,25.72 9.37,25.72 | 9.37,25.72 9.13,25.48 9.13,25.64 9.21,25.72 | 9.68,25.72 10.48,25.72 | 10.48,25.72 10.5,25.72 | 10.5,25.72 10.61,25.72 | 10.61,25.72 C33.1
  Top 0.813: J1.2 8.7,24.86 8.65,24.82
  Bottom 0.305: v21.91,24.45 C13.1 | v27.94,19.37 26.65,19.37 C12.1 | C11.1 v21.91,12.38 | C10.1 v15.88,17.38
  pour Top: 18.1,18.02 17.46,17.38 18.1,16.75
  pour Top: 21.27,22.22 21.91,22.86 22.54,22.22
VCC@3.3V  (via drill 0.4, 0.6, 1)
  Top 0.305: U1.59 28.48,16.41 v27.94,15.88 | U1.80 25.91,24.32 v25.88,24.29 | U1.94 18.91,24.46 v18.89,24.45 | U1.31 18.41,11.74 19.05,12.38 v19.84,12.38 | U1.45 25.41,11.74 24.61,12.38 v23.97,12.38 | U1.9 15.34,20.41 v15.88,20.95 | U2.10 38.24,13.24 37.54,12.54 37.54,9.53 C22.1 36.43,9.53 v35.16,10.79 | C21.1 37.94,6.91
  Top 0.356: 37.94,6.91 37.94,9.14 C22.1
  Top 0.406: FB1.2 L1.2 | 8.14,30.51 C31.1 | U3.1 | 14.68,30.51 C32.1 14.6,30.48 | U3.3 10.8,29.85 10.72,29.77 10.8,29.69 | 8.17,30.48 C31.1 | 13.49,30.48 13.18,30.48 13.02,30.32 13.02,30 | 6.75,25.48 6.75,25.16 6.67,25.08 6.19,25.56 6.19,25.72 6.03,25.88 | 7.71,30.48 C31.1 | 6.03,30.16 v6.03,29.84 | 10.8,30.48 10.64,30.48 10.48,30.32 10.64,30.32 10.8,30.48
  Top 0.508: 12.7,29.69 U3.1 | U3.1 14.68,30.51 | 10.8,29.69 11.03,29.45 12.46,29.45 12.7,29.69 | 13.49,30.48 13.02,30 12.7,29.69 | 6.03,26.19 6.75,25.48
  Top 0.61: 10.72,29.77 10,30.48 | 10,30.48 10.64,30.48 | 10.8,30.48 10.8,29.69 | 10,30.48 8.17,30.48 | v6.03,28.57 v6.03,27.3
  Top 0.813: 14.6,30.48 v14.6,29.13 v14.6,27.86 | L1.2 5.4,30.48 | 6.59,24.76 6.03,25.32 6.03,25.88 6.03,26.19 v6.03,27.3 v6.03,29.84 5.4,30.48 | 6.67,30.48 5.4,30.48 | 7.71,30.48 6.67,30.48 | 6.67,30.48 6.11,29.92 | J1.1 6.75,25.16
  Bottom 0.305: C18.1 24.66,23.07 v25.88,24.29 25.88,25.88 | C19.1 19.84,23.49 v18.89,24.45 18.89,26.04 | C15.1 v19.84,12.38 19.84,10.95 19.68,10.79 | 23.97,10.79 v23.97,12.38 C16.1 | 11.75,20.95 v15.88,20.95 16.83,20.95 17.25,20.54 C14.1 | v27.94,15.88 26.99,15.88 26.59,16.27 26.59,17.36 C17.1
  Bottom 0.356: 12.07,11.11 10.48,9.53 | 10.09,9.13 10.87,9.13 | 10.87,9.13 10.48,9.53 | 10.87,9.13 11.72,9.13 R12.1 | 10.48,9.53 10.09,9.13 | 10.09,9.13 9.24,9.13 R11.1 8.07,9.11 v4.13,5.16
  Bottom 0.406: 27.94,26.04 29.53,24.45 29.53,19.05 27.86,17.38 C17.1 | 11.75,20.95 11.75,11.43 12.07,11.11 12.38,10.79 19.68,10.79 23.97,10.79 v35.16,10.79 | 26.04,26.04 25.88,25.88
  Bottom 0.508: 15.24,26.04 18.89,26.04 26.04,26.04 27.94,26.04
  Bottom 0.61: 14.6,26.67 15.24,26.04 | 6.03,26.67 11.75,20.95
  Bottom 0.813: v14.6,29.13 14.6,26.67 | v6.03,29.84 6.03,26.67
  pour Bottom: 19.53,26.04 18.89,25.4 18.26,26.04
  pour Bottom: 25.24,26.04 25.88,25.4 26.51,26.04
  pour Bottom: 19.21,10.79 19.84,11.43 20.48,10.79
  pour Bottom: 23.97,11.43 23.34,10.79 24.61,10.79
  pour Bottom: 11.75,20.95 12.7,20.95 11.75,20
  pour Bottom: 12.38,10.79 11.75,10.79 11.75,11.43

### Text on the board
tNames: C31 | C32 | RN100 | RN101 | J11 | CS75# | L1/FB1 | FBN13 | U3 | RN102 | RN103 | Red | C1 | U1 | Green | Vcc | J1 | C33 | R13 | R100 | Blue | GND | R14 | R15 | CS# | CLK# | DS# | FBN10-FBN12 | GND | U2 | RN20 | D0-D6 | Fil | Rst#/ | C21 | M | Ctrl/ | J10 | (JTAG) | C22 | A | RN110 | RN111 | RN112 | RN113 | RN120 | RN121 | RN122 | RN123 | GND | R110 | R120 | J12
bNames: Design is based on / the schematics by viletim / (for EPM240T100C5) / Redesign by borti4938 | C23-C27 | C10- / C19 | R10 | R11 | R12 | Vers: N64RGB / 5M_20170901
tStop: __/)__/)_